# Altium schematic sheet Motors.SchDoc
size A
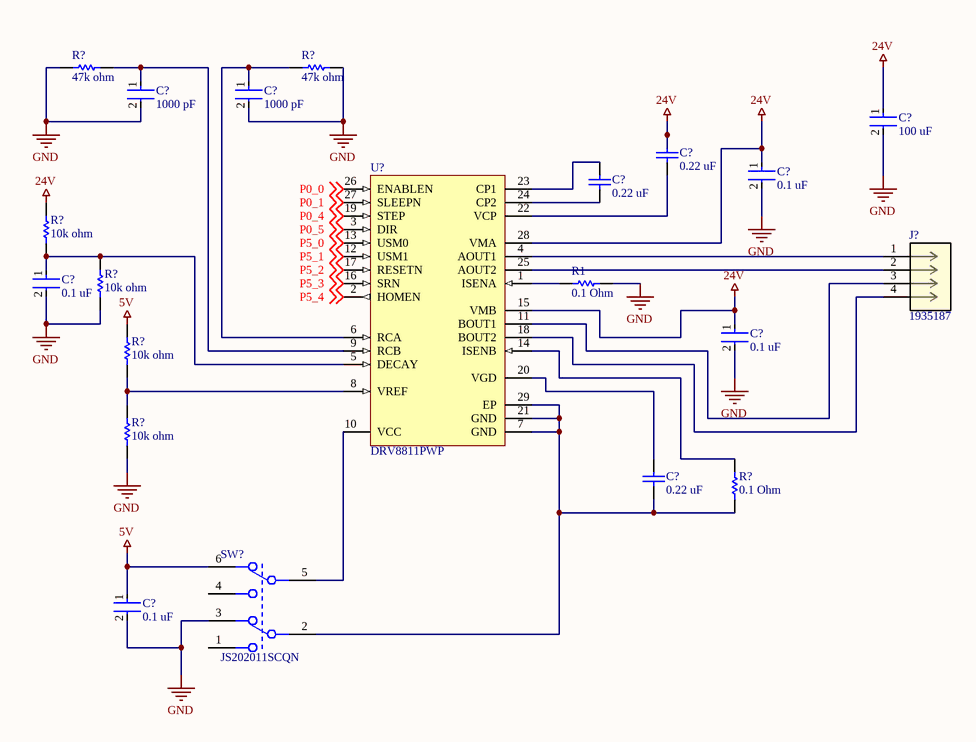
[diagram p0: Motors.SchDoc]

## Parts
(Parts that share a designator on the sheet are numbered #1, #2 ... from top to bottom, then left to right.)
C?#1  1000 pF  [FP-0805-L_2_01_0_2-W_1_25-IPC_C]
C?#2  1000 pF  [FP-0805-L_2_01_0_2-W_1_25-IPC_C]
C?#3  100 uF  [FP-0805-L_2_0_0_2-W_1_25-IPC_A]
C?#4  0.22 uF  [CAPC2013X94X50ML20T25]
C?#5  0.1 uF  [FP-CL21-IPC_C]
C?#6  0.22 uF  [CAPC2013X94X50ML20T25]
C?#7  0.1 uF  [FP-CL21-IPC_C]
C?#8  0.1 uF  [FP-CL21-IPC_C]
C?#9  0.22 uF  [CAPC2013X94X50ML20T25]
C?#10  0.1 uF  [FP-CL21-IPC_C]
J?  1935187  [CONN_1935187_PXC]
R1  0.1 Ohm  [RESC2013X50X40ML20T20]
R?#1  47k ohm  [RESC2013X70X40ML20T20]
R?#2  47k ohm  [RESC2013X70X40ML20T20]
R?#3  10k ohm  [RESC2013X60X35ML10T20]
R?#4  10k ohm  [RESC2013X60X35ML10T20]
R?#5  10k ohm  [RESC2013X60X35ML10T20]
R?#6  10k ohm  [RESC2013X60X35ML10T20]
R?#7  0.1 Ohm  [RESC2013X50X40ML20T20]
SW?  JS202011SCQN  [FP-JS202011SCQN-MFG]
U?  DRV8811PWP  [PWP0028C_M]

## Nets
5V: C?#10.1 R?#5.2 SW?.6
24V: C?#3.1 C?#4.2 C?#5.1 C?#8.1 R?#3.2 U?.15(VMB) U?.28(VMA)
GND: C?#1.2 C?#2.2 C?#3.2 C?#5.2 C?#7.2 C?#8.2 C?#10.2 R1.2 R?#1.1 R?#2.2 R?#4.1 R?#6.1 SW?.3
P0_0: U?.26(ENABLEN) ; off-sheet P0_0
P0_1: U?.27(SLEEPN) ; off-sheet P0_1
P0_4: U?.19(STEP) ; off-sheet P0_4
P0_5: U?.3(DIR) ; off-sheet P0_5
P5_0: U?.13(USM0) ; off-sheet P5_0
P5_1: U?.12(USM1) ; off-sheet P5_1
P5_2: U?.17(RESETN) ; off-sheet P5_2
P5_3: U?.16(SRN) ; off-sheet P5_3
P5_4: U?.2(HOMEN) ; off-sheet P5_4
NetC?#1_1: C?#1.1 R?#1.2 U?.9(RCB)
NetC?#2_1: C?#2.1 R?#2.1 U?.6(RCA)
NetC?#4_1: C?#4.1 U?.22(VCP)
NetC?#6_1: C?#6.1 U?.24(CP2)
NetC?#6_2: C?#6.2 U?.23(CP1)
NetC?#7_1: C?#7.1 R?#3.1 R?#4.2 U?.5(DECAY)
NetC?#9_1: C?#9.1 R?#7.1 SW?.2 U?.7(GND) U?.21(GND) U?.29(EP)
NetC?#9_2: C?#9.2 U?.20(VGD)
NetJ?_1: J?.1 U?.4(AOUT1)
NetJ?_2: J?.2 U?.25(AOUT2)
NetJ?_3: J?.3 U?.11(BOUT1)
NetJ?_4: J?.4 U?.18(BOUT2)
NetR1_1: R1.1 U?.1(ISENA)
NetR?#5_1: R?#5.1 R?#6.2 U?.8(VREF)
NetR?#7_2: R?#7.2 U?.14(ISENB)
NetSW?_5: SW?.5 U?.10(VCC)

Not connected (* = marked no-connect by the designer): SW? 1 4

## Library data of the parts
C?#1 C?#2 = CMP-2007-04270-2: General Purpose Ceramic Capacitor, 0805, 1nF, 5%, C0G, 30ppm/°C, 50V; Insulation Resistance: 100GR; Capacitance: 1nF; Voltage Rating (DC): 50V; Packaging: Tape and Reel; Min Operating Temperature: -55°C; Series: -; Construction: Flat; Tolerance: 5%; RoHS Compliant: Yes; Package Quantity: 1; Case Code (Metric): 2012; Lead Free: Lead Free; Thickness: 0.037inch; REACH SVHC: No SVHC; Temperature Coefficient: 30ppm/°C; Case/Package: 0805; Case Code: 0805; Radiation Hardening: No; Size: 0.94mm; Height: 0.94mm; Width: 0.049inch; Number of Pins: 2; Depth: 1.25mm; Dielectric: C0G; Contact Plating: Tin; Length: 2.01mm; Voltage: 50V; Voltage Rating: 50V; Max Operating Temperature: 125°C; Mount: Surface Mount; Case Code (Imperial): 0805; Termination: SMD/SMT
C?#3 = CMP-14477-004891-2: Multilayer Ceramic Capacitor 100uF 2.5V X5R 20% SMD 0805 T/R; Type: General Purpose; Voltage Rating: 2.5V; Case Code (Metric): 2012; Weight: 0.000194oz; Capacitance: 100uF; Termination: SMD/SMT; Case/Package: 0805; Dielectric: X5R; Tolerance: 20%; Package Quantity: 3000; Case Code (Imperial): 0805; Width: 1.25mm; Height: 1.25mm; Thickness: 0.053inch; Mount: Surface Mount; Min Operating Temperature: -55°C; Max Operating Temperature: 85°C; Voltage Rating (DC): 2.5V; Length: 0.079inch; Packaging: Tape and Reel; RoHS Compliant: Yes
C?#4 C?#6 C?#9 = CMP-2007-04189-1: Part Number: 08051C224KAT2A; Manufacturer: AVX Interconnect / Elco
C?#5 C?#7 C?#8 C?#10 = CMP-2000-05017-2: CL21 Series 0805 100nF 50V ±10% Tolerance X7R Multilayer Ceramic Chip Capacitor; Depth: 1.25mm; Height: 0.85mm; Width: 0.049inch; Tolerance: 10%; Case Code (Metric): 2012; Case Code (Imperial): 0805; Material: Ceramic; Thickness: 0.037inch; Min Operating Temperature: -55°C; Contact Plating: Tin; Length: 2mm; Mount: Surface Mount; Voltage Rating (DC): 50V; Lead Free: Lead Free; Dielectric: X7R; Radiation Hardening: No; Capacitance: 100nF; Voltage Rating: 50V; Case/Package: 0805; Packaging: Tape and Reel; Max Operating Temperature: 125°C; Voltage: 50V
J? = 1935187: No Description Available; Mfr_Name: Phoenix Contact; RefDes: RefDes; Type: Type
R1 R?#7 = CMP-2001-03150-1: Manufacturer: Susumu; Part Number: RL1220S-R10-F
R?#1 R?#2 = CMP-2001-00421-1: Manufacturer: Panasonic; Part Number: ERJ-6GEYJ473V
R?#3-R?#6 = CMP-2000-05025-1: Chip Resistor, 10 KOhm, +/- 5%, 0.125 W, -55 to 155 degC, 0805 (2012 Metric), RoHS, Tape and Reel; Manufacturer: Yageo; Resistor Element Type: ThickFilm; Voltage Rating: 150V; Product Range: RCSeries; SVHC: ToBeAdvised; Resistor Case Style: 0805[2012Metric]; Temperature Coefficient: ±100ppm/degC; Power Rating: 250mW; Resistance: 10kohm; Automotive Qualification Standard: -; Datasheet Version: REV. 2, 09/2004; Packaging: CutTape; Resistance Tolerance: ±5%; MSL: MSL1-Unlimited; Manufacturer URL: http://www.yageo.com/; Datasheet URL: http://www.yageo.ru/pdf/RC0805.pdf; Package Description: 2-Pin Surface Mounted Device, Body 2 x 1.25 mm; Package Reference: 805
SW? = CMP-2000-05087-3: SWITCH SLIDE DPDT 300MA 6V; Switch Function: On-On; Actuator Type: Standard; Switch Travel: 2mm; Actuator Color: Black; Contact Resistance: 70mR; Electrical Life: 5000Cycles; Actuator Material: Nylon; REACH SVHC: No SVHC; Series: JS; Min Operating Temperature: -20°C; Depth: 7.5mm; Housing Material: Nylon; Voltage Rating (DC): 6V; Max Operating Temperature: 85°C; Contact Current Rating: 300mA; Package Quantity: 1; Contact Plating: Silver; Contact Material: Copper Alloy; Throw Configuration: DPDT; Current Rating: 300mA; Orientation: Vertical; Max Current Rating: 300mA; Max Voltage Rating (DC): 6V; Flammability Rating: UL94 V-2; Length: 9mm; Packaging: Tape and Reel; Mount: Surface Mount; Actuator Length: 2mm; Lead Free: Lead Free; Termination: Gull Wing; Radiation Hardening: No
U? = CMP-1556-00004-2: 1.9 A Bipolar Stepper Motor Driver with On-Chip 1 / 8 Microstepping Indexer (Step / Dir Ctrl), -40 to 85 degC, 28-pin HTSSOP (PWP), Green (RoHS & no Sb/Br); Thermal Shutdown: TRUE; Peak Output Current(A): 1.9; PackageVersion: 4073225-6/I, 05/2011; ComponentLink2URL: http://www.ti.com/general/docs/lit/getliterature.tsp?genericPartNumber=DRV8811&fileType=pdf; Eco-Plan: Green (RoHS & no Sb/Br); ComponentLink3URL: http://www.ti.com/litv/pdf/mpds373; PackageDescription: 28-Pin Plastic Small Outline, Body 9.70 x 4.40 mm, Pitch 0.65 mm; DatasheetVersion: SLVS865G; Code_JEDEC: MO-153; ComponentLink1URL: http://www.ti.com/; ComponentLink1Description: Manufacturer URL; ComponentLink2Description: Datasheet; Package Reference: PWP0028C; PartNumber: DRV8811PWP; Mounting Technology: Surface Mount; ComponentLink3Description: Package Specification